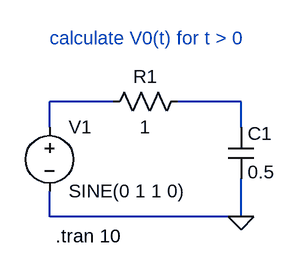
[diagram p0: schematic Lab5_ques2.asc]
Lab5_ques2.asc, the LTspice schematic file:
Version 4
SHEET 1 880 680
WIRE 208 208 128 208
WIRE 368 208 288 208
WIRE 128 240 128 208
WIRE 368 240 368 208
WIRE 128 352 128 320
WIRE 368 352 368 304
WIRE 368 352 128 352
FLAG 368 352 0
SYMBOL Cap 352 240 R0
SYMATTR InstName C1
SYMATTR Value 0.5
SYMBOL Res 304 192 R90
WINDOW 0 0 56 VBottom 2
WINDOW 3 32 56 VTop 2
SYMATTR InstName R1
SYMATTR Value 1
SYMBOL Voltage 128 224 R0
SYMATTR InstName V1
SYMATTR Value SINE(0 1 1 0)
TEXT 128 128 Left 2 ;calculate V0(t) for t > 0
TEXT 136 376 Left 2 !.tran 10

The netlist it stands for:
* Lab5_ques2.asc
C1 N002 0 0.5
R1 N002 N001 1
V1 N001 0 SINE(0 1 1 0)
* calculate V0(t) for t > 0
.tran 10
.backanno
.end